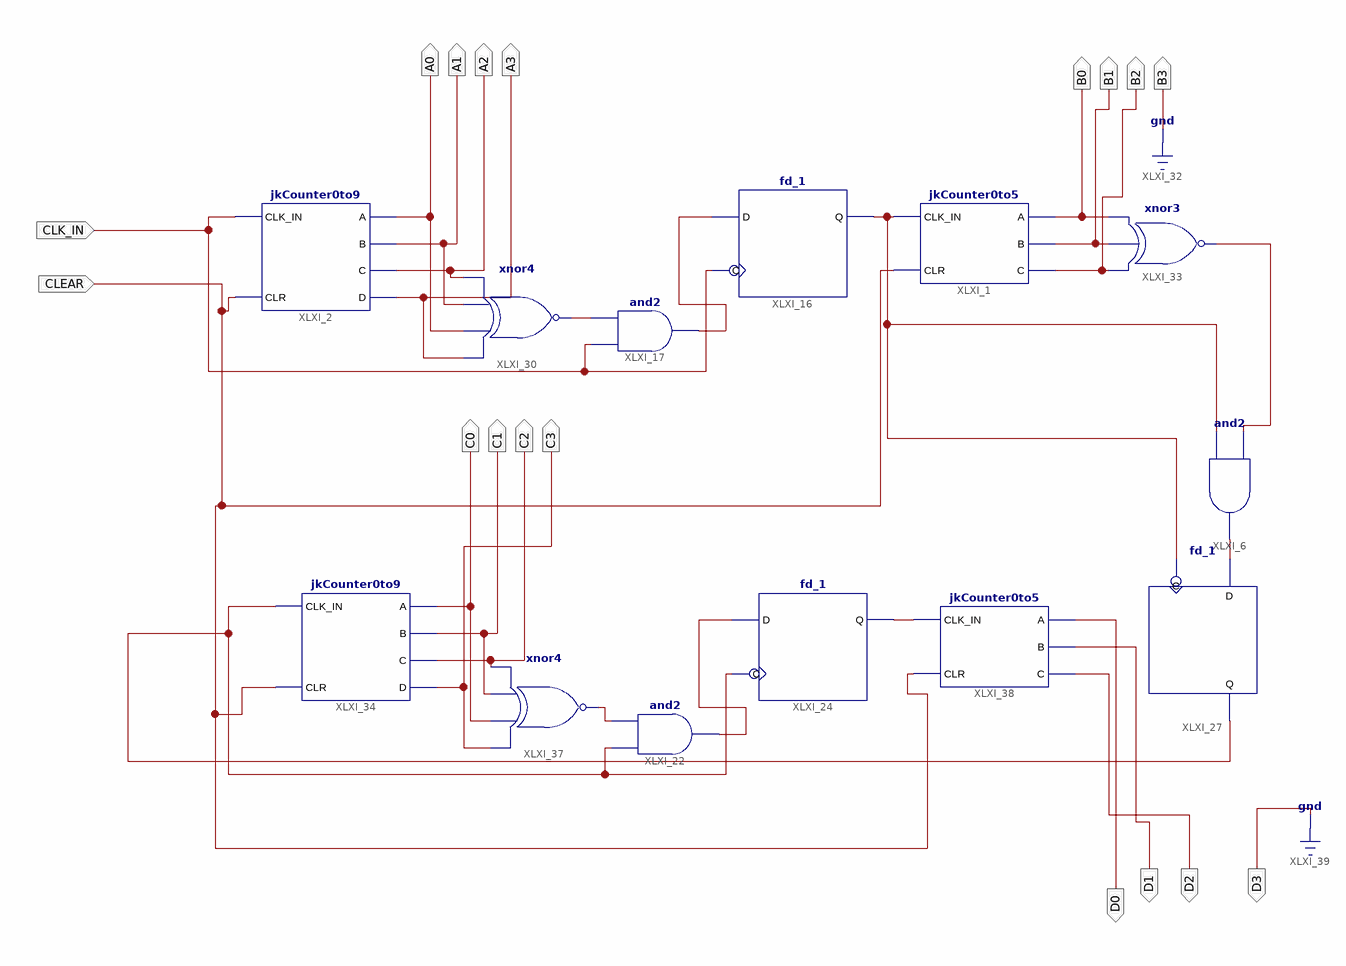
[diagram p0: schematic sheet 1]
// Xilinx ISE schematic timer.sch (spartan6) as structural Verilog: 13 symbols, 18 ports
module timer (
  input  CLK_IN,
  input  CLEAR,
  output B0,
  output D0,
  output D2,
  output D3,
  output D1,
  output B1,
  output B2,
  output A0,
  output A2,
  output A1,
  output A3,
  output B3,
  output C0,
  output C2,
  output C1,
  output C3
);

  wire XLXN_13, XLXN_16, XLXN_32, XLXN_50, XLXN_51, XLXN_57, XLXN_58, XLXN_60, XLXN_61;

  fd_1 XLXI_16 (.C(CLK_IN), .D(XLXN_50), .Q(XLXN_51));
  and XLXI_17 (XLXN_50, CLK_IN, XLXN_32);
  and XLXI_22 (XLXN_60, XLXN_58, XLXN_57);
  fd_1 XLXI_24 (.C(XLXN_58), .D(XLXN_60), .Q(XLXN_61));
  and XLXI_6 (XLXN_16, XLXN_51, XLXN_13);
  fd_1 XLXI_27 (.C(XLXN_51), .D(XLXN_16), .Q(XLXN_58));
  xnor XLXI_30 (XLXN_32, A3, A0, A1, A2);
  jkCounter0to9 XLXI_2 (.CLK_IN(CLK_IN), .A(A0), .B(A1), .C(A2), .D(A3), .CLR(CLEAR));
  xnor XLXI_33 (XLXN_13, B2, B1, B0);
  jkCounter0to9 XLXI_34 (.CLK_IN(XLXN_58), .A(C0), .B(C1), .C(C2), .D(C3), .CLR(CLEAR));
  xnor XLXI_37 (XLXN_57, C3, C0, C1, C2);
  jkCounter0to5 XLXI_1 (.A(B0), .B(B1), .C(B2), .CLK_IN(XLXN_51), .CLR(CLEAR));
  jkCounter0to5 XLXI_38 (.A(D0), .B(D1), .C(D2), .CLK_IN(XLXN_61), .CLR(CLEAR));

  assign B3 = 1'b0;
  assign D3 = 1'b0;
endmodule
